# Altium schematic sheet Ollie_DriverMotors.SchDoc
size C
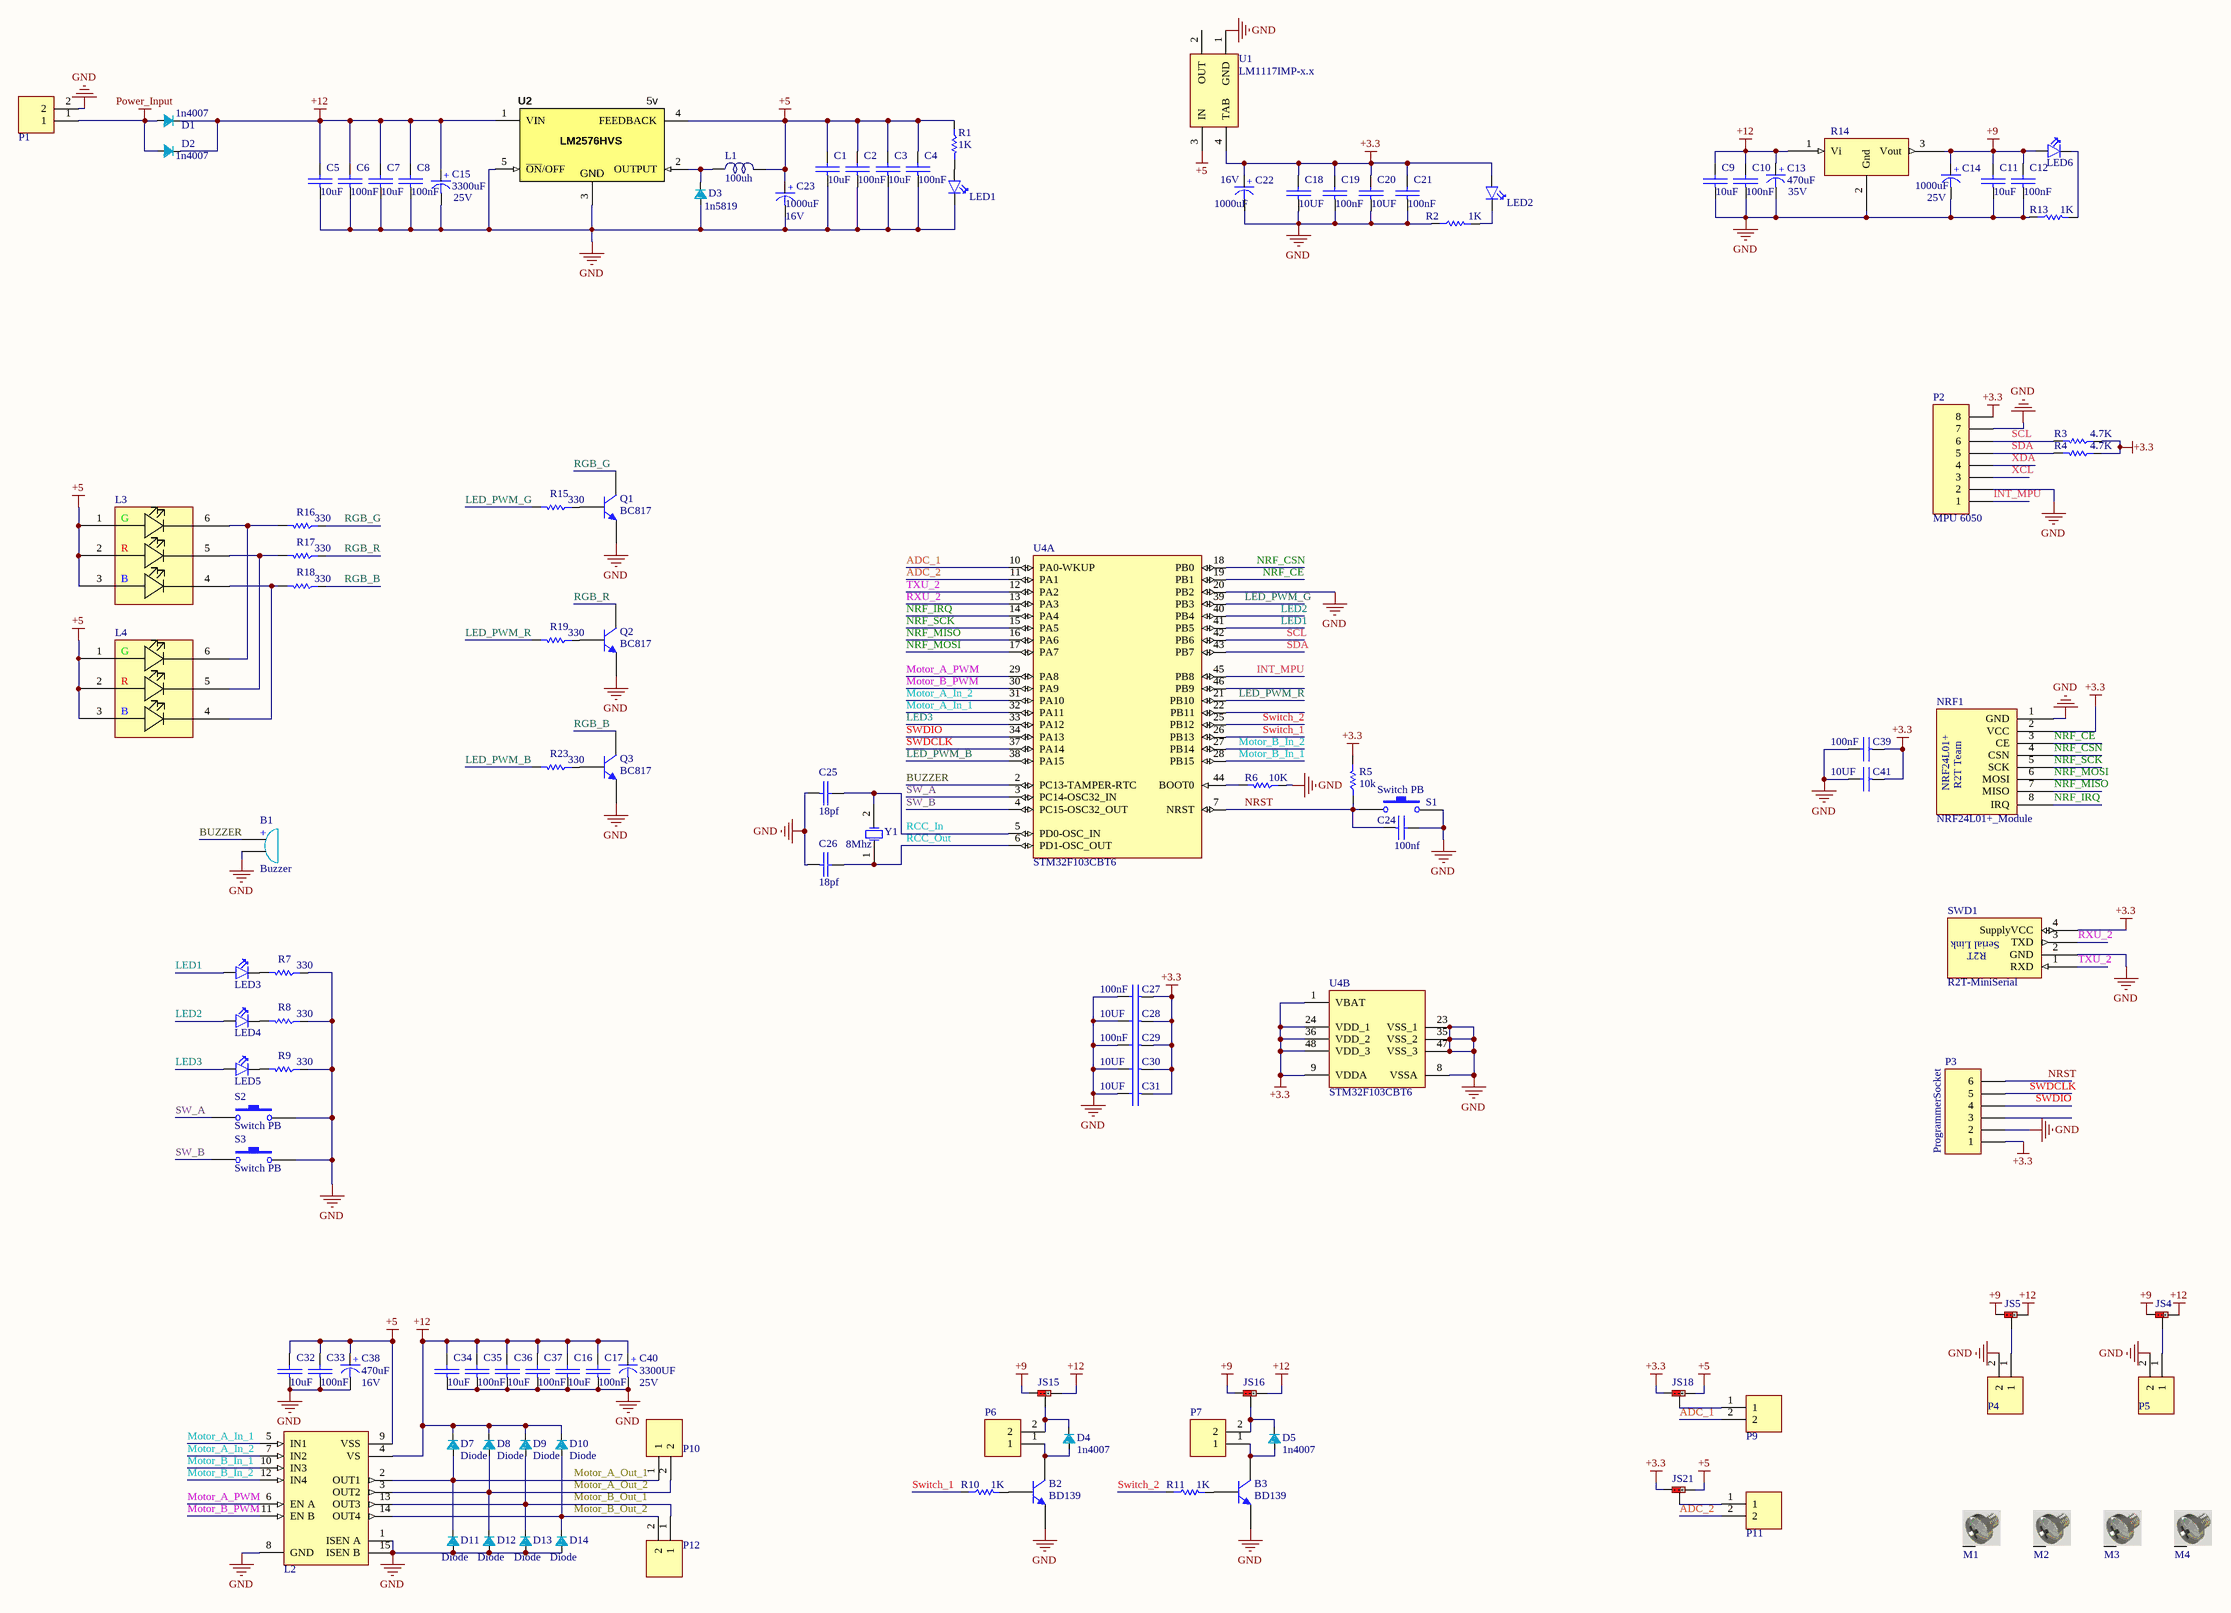
[diagram p0: Ollie_DriverMotors.SchDoc]

## Parts
B1  Buzzer  [Buzzer]
B2  BD139  [BD139]
B3  BD139  [BD139]
C1  10uF  [SMD_CAP_1206]
C2  100nF  [SMD_CAP_1206]
C3  10uF  [SMD_CAP_1206]
C4  100nF  [SMD_CAP_1206]
C5  10uF  [SMD_CAP_1206]
C6  100nF  [SMD_CAP_1206]
C7  10uF  [SMD_CAP_1206]
C8  100nF  [SMD_CAP_1206]
C9  10uF  [SMD_CAP_1206]
C10  100nF  [SMD_CAP_1206]
C11  10uF  [SMD_CAP_1206]
C12  100nF  [SMD_CAP_1206]
C13  Voltage: 35V  [cap 03]  (hidden comment: 470uF)
C14  Voltage: 25V  [cap 03]  (hidden comment: 1000uF)
C15  Voltage: 25V  [CAP 05]  (hidden comment: 3300uF)
C16  10uF  [SMD_CAP_1206]
C17  100nF  [SMD_CAP_1206]
C18  10UF  [SMD_CAP_1206]
C19  100nF  [SMD_CAP_1206]
C20  10UF  [SMD_CAP_1206]
C21  100nF  [SMD_CAP_1206]
C22  Voltage: 16V  [cap 03]  (hidden comment: 1000uF)
C23  Voltage: 16V  [cap 04]  (hidden comment: 1000uF)
C24  100nf  [SMD_CAP_0805]
C25  18pf  [SMD_CAP_0805]
C26  18pf  [SMD_CAP_0805]
C27  100nF  [SMD_CAP_1206]
C28  10UF  [SMD_CAP_1206]
C29  100nF  [SMD_CAP_1206]
C30  10UF  [SMD_CAP_1206]
C31  10UF  [SMD_CAP_1206]
C32  10uF  [SMD_CAP_1206]
C33  100nF  [SMD_CAP_1206]
C34  10uF  [SMD_CAP_1206]
C35  100nF  [SMD_CAP_1206]
C36  10uF  [SMD_CAP_1206]
C37  100nF  [SMD_CAP_1206]
C38  Voltage: 16V  [cap 03]  (hidden comment: 470uF)
C39  100nF  [SMD_CAP_1206]
C40  Voltage: 25V  [CAP 05]  (hidden comment: 3300UF)
C41  10UF  [SMD_CAP_1206]
D1  Description:: 1n4007  [DO-214AC ( SMD Diode )]  (hidden comment: SMD Diodes)
D2  Description:: 1n4007  [DO-214AC ( SMD Diode )]  (hidden comment: SMD Diodes)
D3  Description:: 1n5819  [DO-214AC ( SMD Diode )]  (hidden comment: SMD Diodes)
D4  Description:: 1n4007  [DO-214AC ( SMD Diode )]  (hidden comment: SMD Diodes)
D5  Description:: 1n4007  [DO-214AC ( SMD Diode )]  (hidden comment: SMD Diodes)
D7  Description:: Diode  [DO-214AC ( SMD Diode )]  (hidden comment: SMD Diodes)
D8  Description:: Diode  [DO-214AC ( SMD Diode )]  (hidden comment: SMD Diodes)
D9  Description:: Diode  [DO-214AC ( SMD Diode )]  (hidden comment: SMD Diodes)
D10  Description:: Diode  [DO-214AC ( SMD Diode )]  (hidden comment: SMD Diodes)
D11  Description:: Diode  [DO-214AC ( SMD Diode )]  (hidden comment: SMD Diodes)
D12  Description:: Diode  [DO-214AC ( SMD Diode )]  (hidden comment: SMD Diodes)
D13  Description:: Diode  [DO-214AC ( SMD Diode )]  (hidden comment: SMD Diodes)
D14  Description:: Diode  [DO-214AC ( SMD Diode )]  (hidden comment: SMD Diodes)
JS4  JumperSMD 3Pin  [JumperSMD 3Pin]  (value not drawn)
JS5  JumperSMD 3Pin  [JumperSMD 3Pin]  (value not drawn)
JS15  JumperSMD 3Pin  [JumperSMD 3Pin]  (value not drawn)
JS16  JumperSMD 3Pin  [JumperSMD 3Pin]  (value not drawn)
JS18  JumperSMD 3Pin  [JumperSMD 3Pin]  (value not drawn)
JS21  JumperSMD 3Pin  [JumperSMD 3Pin]  (value not drawn)
L1  100uh  [General 10x12(200m) Inductor]
L2  L298n  [Multiwatt15V]  (value not drawn)
L3  LED RGB  [LED_5050]  (value not drawn)
L4  LED RGB  [LED_5050]  (value not drawn)
LED1  LED  [LED0805]  (value not drawn)
LED2  LED  [LED0805]  (value not drawn)
LED3  LED  [LED0805]  (value not drawn)
LED4  LED  [LED0805]  (value not drawn)
LED5  LED  [LED0805]  (value not drawn)
LED6  LED  [LED0805]  (value not drawn)
M1  Screw  [Board Screw]  (value not drawn)
M2  Screw  [Board Screw]  (value not drawn)
M3  Screw  [Board Screw]  (value not drawn)
M4  Screw  [Board Screw]  (value not drawn)
NRF1  NRF24L01+_Module  [NRF24L01+_Module-LNA+PA]
P1  Connector  [Terminal Block 2pin]  (value not drawn)
P2  MPU 6050  [HDR1X8]
P3  ProgrammerSocket  [HDR1X6]
P4  Connector  [Polarized Header 2]  (value not drawn)
P5  Connector  [Polarized Header 2]  (value not drawn)
P6  Connector  [Polarized Header 2]  (value not drawn)
P7  Connector  [Polarized Header 2]  (value not drawn)
P9  Connector  [Polarized Header 2]  (value not drawn)
P10  Connector  [Terminal Block 2pin]  (value not drawn)
P11  Connector  [Polarized Header 2]  (value not drawn)
P12  Connector  [Terminal Block 2pin]  (value not drawn)
Q1  BC817  [SOT23_BEC_N]
Q2  BC817  [SOT23_BEC_N]
Q3  BC817  [SOT23_BEC_N]
R1  1K  [RES 0805 (2012X06L)]
R2  1K  [RES 0805 (2012X06L)]
R3  4.7K  [RES 0805 (2012X06L)]
R4  4.7K  [RES 0805 (2012X06L)]
R5  10k  [RES 0805 (2012X06L)]
R6  10K  [RES 0805 (2012X06L)]
R7  330  [RES 0805 (2012X06L)]
R8  330  [RES 0805 (2012X06L)]
R9  330  [RES 0805 (2012X06L)]
R10  1K  [RES 0805 (2012X06L)]
R11  1K  [RES 0805 (2012X06L)]
R13  1K  [RES 0805 (2012X06L)]
R14  L78XX  [To-220]  (value not drawn)
R15  330  [RES 0805 (2012X06L)]
R16  330  [RES 0805 (2012X06L)]
R17  330  [RES 0805 (2012X06L)]
R18  330  [RES 0805 (2012X06L)]
R19  330  [RES 0805 (2012X06L)]
R23  330  [RES 0805 (2012X06L)]
S1  Switch PB  [SW-PB]
S2  Switch PB  [SW-PB]
S3  Switch PB  [SW-PB]
SWD1  R2T-MiniSerial  [SerialWireMini]
U1  LM1117IMP-x.x  [MP04A_N]
U2  value 5v  [TO-263-5]  (hidden comment: Adjustable)
U4  STM32F103CBT6  [STM-LQFP48_N]  (parts A,B of 2)
Y1  8Mhz  [Crystal SMD]

## Nets
+3.3: C18.1(+) C19.1(+) C20.1(+) C21.1(+) C22.1(+) C27.2(-) C28.2(-) C29.2(-) C30.2(-) C31.2(-) C39.2(-) C41.2(-) JS18.3 JS21.3 LED2.1(A) NRF1.2(VCC) P2.8 P3.1 R3.1 R4.1 R5.2 SWD1.4(SupplyVCC) U1.4(TAB) U4.1(VBAT) U4.9(VDDA) U4.24(VDD_1) U4.36(VDD_2) U4.48(VDD_3)
+5: C1.1(+) C2.1(+) C3.1(+) C4.1(+) C23.1(+) C32.1(+) C33.1(+) C38.1(+) JS18.1 JS21.1 L1.2 L2.9(VSS) L3.1(G) L3.2(R) L3.3(B) L4.1(G) L4.2(R) L4.3(B) R1.1 U1.3(IN) U2.4(FEEDBACK)
+9: C11.1(+) C12.1(+) C14.1(+) JS4.3 JS5.3 JS15.3 JS16.3 LED6.1(A) R14.3(Vout)
+12: C5.1(+) C6.1(+) C7.1(+) C8.1(+) C9.1(+) C10.1(+) C13.1(+) C15.1(+) C16.1(+) C17.1(+) C34.1(+) C35.1(+) C36.1(+) C37.1(+) C40.1(+) D1.1 D2.1 D7.1 D8.1 D9.1 D10.1 JS4.1 JS5.1 JS15.1 JS16.1 L2.4(VS) R14.1(Vi) U2.1(VIN)
GND: B1.2(GND) B2.E B3.E C1.2(-) C2.2(-) C3.2(-) C4.2(-) C5.2(-) C6.2(-) C7.2(-) C8.2(-) C9.2(-) C10.2(-) C11.2(-) C12.2(-) C13.2(-) C14.2(-) C15.2(-) C16.2(-) C17.2(-) C18.2(-) C19.2(-) C20.2(-) C21.2(-) C22.2(-) C23.2(-) C24.1(+) C25.2(-) C26.2(-) C27.1(+) C28.1(+) C29.1(+) C30.1(+) C31.1(+) C32.2(-) C33.2(-) C34.2(-) C35.2(-) C36.2(-) C37.2(-) C38.2(-) C39.1(+) C40.2(-) C41.1(+) D3.0 D11.0 D12.0 D13.0 D14.0 L2.1(ISEN_A) L2.8(GND) L2.15(ISEN_B) LED1.2(K) NRF1.1(GND) P1.2 P2.2 P2.7 P3.2 P4.2 P5.2 Q1.2(E) Q2.2(E) Q3.2(E) R2.1 R6.1 R7.1 R8.1 R9.1 R13.1 R14.2(Gnd) S1.2 S2.2 S3.2 SWD1.2(GND) U1.1(GND) U2.3(GND) U2.5(~{ON}/OFF) U4.8(VSSA) U4.20(PB2) U4.23(VSS_1) U4.35(VSS_2) U4.47(VSS_3)
Power_Input: D1.0 D2.0 P1.1
ADC_1: P9.2 U4.10(PA0-WKUP)
ADC_2: P11.2 U4.11(PA1)
BUZZER: B1.1(VCC) U4.2(PC13-TAMPER-RTC)
INT_MPU: P2.1 U4.45(PB8)
LED1: LED3.1(A) U4.41(PB5)
LED2: LED4.1(A) U4.40(PB4)
LED3: LED5.1(A) U4.33(PA12)
LED_PWM_B: R23.2 U4.38(PA15)
LED_PWM_G: R15.2 U4.39(PB3)
LED_PWM_R: R19.2 U4.21(PB10)
Motor_A_In_1: L2.5(IN1) U4.32(PA11)
Motor_A_In_2: L2.7(IN2) U4.31(PA10)
Motor_A_Out_1: D7.0 D11.1 L2.2(OUT1) P10.1
Motor_A_Out_2: D8.0 D12.1 L2.3(OUT2) P10.2
Motor_A_PWM: L2.6(EN_A) U4.29(PA8)
Motor_B_In_1: L2.10(IN3) U4.28(PB15)
Motor_B_In_2: L2.12(IN4) U4.27(PB14)
Motor_B_Out_1: D9.0 D13.1 L2.13(OUT3) P12.1
Motor_B_Out_2: D10.0 D14.1 L2.14(OUT4) P12.2
Motor_B_PWM: L2.11(EN_B) U4.30(PA9)
NRF_CE: NRF1.3(CE) U4.19(PB1)
NRF_CSN: NRF1.4(CSN) U4.18(PB0)
NRF_IRQ: NRF1.8(IRQ) U4.14(PA4)
NRF_MISO: NRF1.7(MISO) U4.16(PA6)
NRF_MOSI: NRF1.6(MOSI) U4.17(PA7)
NRF_SCK: NRF1.5(SCK) U4.15(PA5)
NRST: C24.2(-) P3.6 R5.1 S1.1 U4.7(NRST)
RCC_In: C25.1(+) U4.5(PD0-OSC_IN) Y1.2(OSC2)
RCC_Out: C26.1(+) U4.6(PD1-OSC_OUT) Y1.1(OSC1)
RGB_B: Q3.3(C) R18.1
RGB_G: Q1.3(C) R16.1
RGB_R: Q2.3(C) R17.1
RXU_2: SWD1.3(TXD) U4.13(PA3)
SCL: P2.6 R3.2 U4.42(PB6)
SDA: P2.5 R4.2 U4.43(PB7)
SW_A: S2.1 U4.3(PC14-OSC32_IN)
SW_B: S3.1 U4.4(PC15-OSC32_OUT)
SWDCLK: P3.5 U4.37(PA14)
SWDIO: P3.4 U4.34(PA13)
Switch_1: R10.1 U4.26(PB13)
Switch_2: R11.1 U4.25(PB12)
TXU_2: SWD1.1(RXD) U4.12(PA2)
XCL: P2.3
XDA: P2.4
NetB2_B: B2.B R10.2
NetB2_C: B2.C D4.0 P6.1
NetB3_B: B3.B R11.2
NetB3_C: B3.C D5.0 P7.1
NetD3_1: D3.1 L1.1 U2.2(OUTPUT)
NetD4_1: D4.1 JS15.2 P6.2
NetD5_1: D5.1 JS16.2 P7.2
NetJS4_2: JS4.2 P5.1
NetJS5_2: JS5.2 P4.1
NetJS18_2: JS18.2 P9.1
NetJS21_2: JS21.2 P11.1
NetL3_4: L3.4 L4.4 R18.2
NetL3_5: L3.5 L4.5 R17.2
NetL3_6: L3.6 L4.6 R16.2
NetLED1_1: LED1.1(A) R1.2
NetLED2_2: LED2.2(K) R2.2
NetLED3_2: LED3.2(K) R7.2
NetLED4_2: LED4.2(K) R8.2
NetLED5_2: LED5.2(K) R9.2
NetLED6_2: LED6.2(K) R13.2
NetQ1_1: Q1.1(B) R15.1
NetQ2_1: Q2.1(B) R19.1
NetQ3_1: Q3.1(B) R23.1
NetR6_2: R6.2 U4.44(BOOT0)

Not connected (* = marked no-connect by the designer): M1 S; M2 S; M3 S; M4 S; P3 3; U1 2(OUT); U4 22(PB11) 46(PB9)

## Notes on the sheet
- (in symbol Buzzer) +
- (in symbol NRF24L01+_Module) NRF24L01+; R2T Team
- (in symbol R2T-MiniSerial) Serial Link; R2T

## Library data of the parts
B1 = Buzzer: Designer: Hamed Jafarzadeh
B2 B3 = BD139: BJT
C1-C12 C16-C21 C24-C37 C39 C41 = Cap-Bipolar: Bipolar Capacitor; Voltage: 100V; Designer: Saeid Jorablo; Organazation: ControTec; Adding Date: 1387/12/20
  C1 C3 C5 C7 C9 C11 C16 C32 C34 C36: Value: 10uF
  C2 C4 C6 C8 C10 C12 C17 C19 C21 C27 C29 C33 C35 C37 C39: Value: 100nF
  C18 C20 C28 C30 C31 C41: Value: 10UF
  C24: Value: 100nf
  C25 C26: Value: 18pf
C13-C15 C22 C23 C38 C40 = Cap-Polar: Polar Capacitor; Designer: Saeid Jorablo; Organazation: ControTec; Adding Date: 1387/12/20
  C13 C38: Value: 470uF
  C14 C22 C23: Value: 1000uF
  C15: Value: 3300uF
  C40: Value: 3300UF
D1-D5 D7-D14 = SMD Diodes: Designer :: Hamed Jafarzadeh
L1 = Inductor: Designer:: Hamed Jafarzadeh - hjafarzadeh511@gmail.com
L2 = L298n: Motor Driver
L3 L4 = LED RGB: LED 5050 RGB
LED1-LED6 = LED: Designer :: Razi Research Team Of Mashhad - Hamed Jafarzadeh
M1-M4 = Board Screw: Board Screw With Spacer
NRF1 = NRF24L01+_Module: Designer:: HamedJafarzadeh
P1 P4-P7 P9-P12 = Connector 2Pin: Designer:: Hamed Jafarzadeh - www.R2T.ir
P2 = Header 8: Header, 8-Pin; LatestRevisionDate: 17-Jul-2002; LatestRevisionNote: Re-released for DXP Platform.; Publisher: Altium Limited
P3 = Header 6: Header, 6-Pin; LatestRevisionDate: 17-Jul-2002; LatestRevisionNote: Re-released for DXP Platform.; Publisher: Altium Limited
Q1-Q3 = NPN: NPN Bipolar Transistor; Published: 8-Jun-2000; LatestRevisionDate: 29-May-2009; LatestRevisionNote: IPC-7351 Footprint Added.; PackageVersion: Aug-1999; PackageReference: SOT-23B; Publisher: Altium Limited; PackageDescription: 3-Pin SOT-23 Package 0.95 mm Pitch, 2.4 mm Lead Span
R1-R11 R13 R15-R19 R23 = Resistor: Tolerance: 5%; Power: 1/8 W
  R1 R2 R10 R11 R13: Value: 1K
  R3 R4: Value: 4.7K
  R5: Value: 10k
  R6: Value: 10K
  R7-R9 R15-R19 R23: Value: 330
R14 = L78XX: Linear Regulator
S1-S3 = Switch PB: Push Button Switch
U1 = LM1117IMP-x.x: x.x Volt, 800mA Low-Dropout Linear Regulator, 4-pin SOT-223; PartNumber: LM1117IMP-3.3; Manufacturer: National Semiconductor; PackageTopMarking: XYTT*N05B; PowerWise: N; CompType: LDO IC; Published: 4-Dec-2008; DatasheetVersion: Apr-2006; PackageVersion: revB, Apr-2003; PackageReference: MP04A; Publisher: Altium Limited; PackageDescription: Molded SOT-223, 6.50 x 3.56 x 1.6mm Body, 4 Lead, 2.3mm Pitch; Supplier 1: Farnell; Supplier Part Number 1: 7614123; RoHS: N; PinCount: 4; Code_JEDEC: TO-261-AA; Code_IPC: SOT223-4; ComponentLink1Description: LM1117 Datasheet; ComponentLink1URL: http://www.national.com/ds/LM/LM1117.pdf; ComponentLink2Description: LM1117 Web Page; ComponentLink2URL: http://www.national.com/pf/LM/LM1117.html; ComponentLink3Description: MP04A Package Page; ComponentLink3URL: http://www.national.com/packaging/folders/mp04a.html
U2 = LM2576HVS: Switching Voltage Regulator IC, TO-263-5 SMD, LM2591HVS-5.0; Manufacturer 1: National Semiconductor; Voltage Regulator Type: Switching Buck; Tolerance: ±4%; Ratings: 60Vin Max; 150kHz; SCDType: source; Package / Case: TO-263-5; Supplier 1: Digi-Key; Supplier Part Number 1: LM2591HVS-5.0-ND; Manufacturer Part Number 1: LM2576HVS
U4 = STM32F103CBT6: ARM Cortex-M3 32-bit MCU, 128 KB Flash, 20 KB Internal RAM, 37 I/Os, 48-pin LQFP, -40 to 85 degC, Tray; A/D Converter: 2x12-bit (10 Channel); FLASH Size (Prog) (kB): 128; I/Os (High Current): 37; Internal RAM Size (kB): 20; Operating Frequency(F) (Processor speed) (MHz): 72; Supply Voltage(Vcc) min (V): 2; DatasheetVersion: Rev. 16; PackageVersion: Rev. 6, 06/2013; PackageReference: LQFP48; PackageDescription: 48-Pin Low Profile Quad Flat Package, 7 x 7 mm Body, 0.5 mm Pitch; Supplier 1: Digi-Key; Supplier Part Number 1: 497-6288-ND; Supplier 2: Farnell; Supplier Part Number 2: 1606327; Supplier 3: Newark; Supplier Part Number 3: 11N8296; Supplier 4: Newark; Supplier Part Number 4: 57P1214; Supplier 5: Mouser; Supplier Part Number 5: 511-STM32F103CBT6; Core: ARM Cortex-M3; Packing: Tray; Mounting Technology: Surface Mount; PartNumber: STM32F103CBT6; ComponentLink1Description: Manufacturer URL; ComponentLink1URL: http://www.st.com/web/en/home.html; ComponentLink2Description: Datasheet; ComponentLink2URL: http://www.st.com/st-web-ui/static/active/en/resource/technical/document/datasheet/CD00161566.pdf; ComponentLink3Description: Package Specification; ComponentLink3URL: http://www.st.com/st-web-ui/static/active/en/resource/technical/document/datasheet/DM00058181.pdf
Y1 = XTAL: XTAL Crystal; Company: E.P.I.L; Design Date: 11/04/2011; Value: 8Mhz